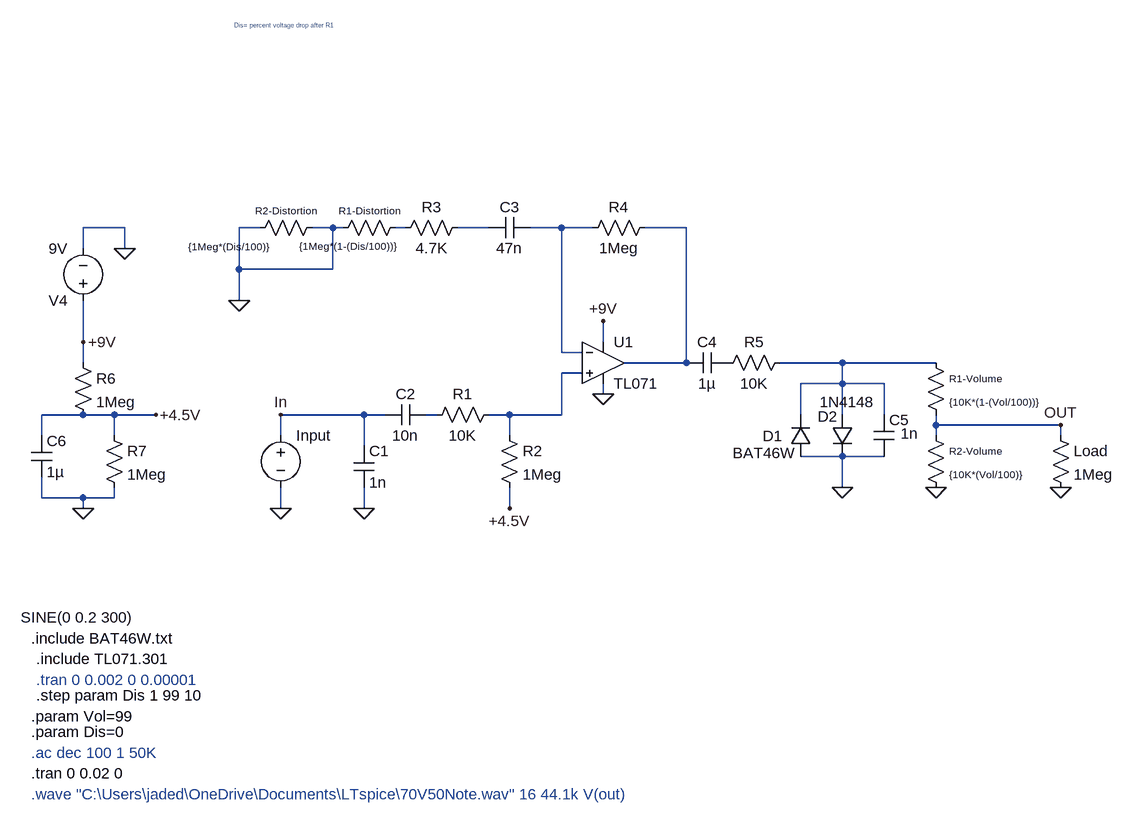
[diagram p0: schematic DistortionPedal.asc]
DistortionPedal.asc, the LTspice schematic file:
Version 4.1
SHEET 1 880 680
WIRE -1856 -368 -1920 -368
WIRE -1648 -368 -1680 -368
WIRE -1536 -368 -1568 -368
WIRE -1520 -368 -1536 -368
WIRE -1424 -368 -1440 -368
WIRE -1296 -368 -1344 -368
WIRE -1184 -368 -1232 -368
WIRE -1136 -368 -1184 -368
WIRE -992 -368 -1056 -368
WIRE -1920 -336 -1920 -368
WIRE -1856 -336 -1856 -368
WIRE -1680 -304 -1680 -368
WIRE -1536 -304 -1536 -368
WIRE -1536 -304 -1680 -304
WIRE -1680 -256 -1680 -304
WIRE -1920 -192 -1920 -256
WIRE -1120 -192 -1120 -224
WIRE -1184 -176 -1184 -368
WIRE -1152 -176 -1184 -176
WIRE -1920 -160 -1920 -192
WIRE -992 -160 -992 -368
WIRE -992 -160 -1088 -160
WIRE -976 -160 -992 -160
WIRE -752 -160 -848 -160
WIRE -608 -160 -752 -160
WIRE -1152 -144 -1184 -144
WIRE -752 -128 -752 -160
WIRE -752 -128 -816 -128
WIRE -688 -128 -752 -128
WIRE -1120 -112 -1120 -128
WIRE -1920 -80 -1984 -80
WIRE -1872 -80 -1920 -80
WIRE -1808 -80 -1872 -80
WIRE -1488 -80 -1616 -80
WIRE -1456 -80 -1488 -80
WIRE -1376 -80 -1392 -80
WIRE -1264 -80 -1296 -80
WIRE -1184 -80 -1184 -144
WIRE -1184 -80 -1264 -80
WIRE -816 -80 -816 -128
WIRE -752 -80 -752 -128
WIRE -688 -80 -688 -128
WIRE -608 -64 -608 -80
WIRE -416 -64 -608 -64
WIRE -1984 -48 -1984 -80
WIRE -1872 -48 -1872 -80
WIRE -1616 -48 -1616 -80
WIRE -1264 -48 -1264 -80
WIRE -608 -48 -608 -64
WIRE -416 -48 -416 -64
WIRE -1488 -32 -1488 -80
WIRE -752 -16 -816 -16
WIRE -688 -16 -752 -16
WIRE -752 32 -752 -16
WIRE -1984 48 -1984 16
WIRE -1920 48 -1984 48
WIRE -1872 48 -1872 32
WIRE -1872 48 -1920 48
WIRE -1920 64 -1920 48
WIRE -1616 64 -1616 32
WIRE -1488 64 -1488 32
WIRE -1264 64 -1264 32
FLAG -1680 -256 0
FLAG -1616 64 0
FLAG -1488 64 0
FLAG -1120 -112 0
FLAG -752 32 0
FLAG -608 32 0
FLAG -416 -64 OUT
FLAG -416 32 0
FLAG -1856 -336 0
FLAG -1120 -224 +9V
FLAG -1920 -192 +9V
FLAG -1920 64 0
FLAG -1808 -80 +4.5V
FLAG -1264 64 +4.5V
FLAG -1616 -80 In
SYMBOL res -1328 -384 R90
WINDOW 0 0 56 VBottom 2
WINDOW 3 32 56 VTop 2
SYMATTR InstName R3
SYMATTR Value 4.7K
SYMBOL cap -1232 -384 R90
WINDOW 0 0 32 VBottom 2
WINDOW 3 32 32 VTop 2
SYMATTR InstName C3
SYMATTR Value 47n
SYMBOL voltage -1616 -64 R0
WINDOW 3 -400 296 Left 2
WINDOW 123 0 0 Left 0
WINDOW 39 0 0 Left 0
SYMATTR Value SINE(0 0.2 300)
SYMATTR InstName Input
SYMBOL cap -1504 -32 R0
SYMATTR InstName C1
SYMATTR Value 1n
SYMBOL cap -1392 -96 R90
WINDOW 0 0 32 VBottom 2
WINDOW 3 32 32 VTop 2
SYMATTR InstName C2
SYMATTR Value 10n
SYMBOL res -1280 -96 R90
WINDOW 0 0 56 VBottom 2
WINDOW 3 32 56 VTop 2
SYMATTR InstName R1
SYMATTR Value 10K
SYMBOL res -1280 -64 R0
SYMATTR InstName R2
SYMATTR Value 1Meg
SYMBOL OpAmps\\opamp2 -1120 -224 R0
SYMATTR InstName U1
SYMATTR Value TL071
SYMATTR SpiceModel TL071
SYMBOL res -1040 -384 R90
WINDOW 0 0 56 VBottom 2
WINDOW 3 32 56 VTop 2
SYMATTR InstName R4
SYMATTR Value 1Meg
SYMBOL cap -928 -176 R90
WINDOW 0 0 32 VBottom 2
WINDOW 3 32 32 VTop 2
SYMATTR InstName C4
SYMATTR Value 1µ
SYMBOL res -832 -176 R90
WINDOW 0 0 56 VBottom 2
WINDOW 3 32 56 VTop 2
SYMATTR InstName R5
SYMATTR Value 10K
SYMBOL diode -800 -16 R180
WINDOW 0 44 31 Left 2
WINDOW 3 25 5 Left 2
SYMATTR InstName D1
SYMATTR Value BAT46W
SYMBOL diode -768 -80 R0
WINDOW 3 66 -20 Right 2
WINDOW 0 -22 3 Left 2
SYMATTR Value 1N4148
SYMATTR InstName D2
SYMBOL cap -704 -80 R0
WINDOW 3 42 29 Left 2
SYMATTR Value 1n
SYMATTR InstName C5
SYMBOL res -1424 -384 R90
WINDOW 0 0 56 VBottom 1
WINDOW 3 34 89 VTop 1
SYMATTR InstName R1-Distortion
SYMATTR Value {1Meg*(1-(Dis/100))}
SYMBOL res -1552 -384 R90
WINDOW 0 0 56 VBottom 1
WINDOW 3 35 145 VTop 1
SYMATTR InstName R2-Distortion
SYMATTR Value {1Meg*(Dis/100)}
SYMBOL res -624 -176 R0
WINDOW 0 36 40 Left 1
WINDOW 3 36 76 Left 1
SYMATTR InstName R1-Volume
SYMATTR Value {10K*(1-(Vol/100))}
SYMBOL res -624 -64 R0
WINDOW 0 36 40 Left 1
WINDOW 3 36 76 Left 1
SYMATTR InstName R2-Volume
SYMATTR Value {10K*(Vol/100)}
SYMBOL res -432 -64 R0
SYMATTR InstName Load
SYMATTR Value 1Meg
SYMBOL voltage -1920 -240 R180
WINDOW 123 0 0 Left 0
WINDOW 39 0 0 Left 0
SYMATTR InstName V4
SYMATTR Value 9V
SYMBOL res -1936 -176 R0
SYMATTR InstName R6
SYMATTR Value 1Meg
SYMBOL cap -2000 -48 R0
SYMATTR InstName C6
SYMATTR Value 1µ
SYMBOL res -1888 -64 R0
SYMATTR InstName R7
SYMATTR Value 1Meg
TEXT -1992 296 Left 2 !.include TL071.301
TEXT -1688 -680 Left 0 ;Dis= percent voltage drop after R1
TEXT -1992 328 Left 2 ;.tran 0 0.002 0 0.00001
TEXT -1992 352 Left 2 !.step param Dis 1 99 10
TEXT -2000 408 Left 2 !.param Dis=0
TEXT -2000 440 Left 2 ;.ac dec 100 1 50K
TEXT -2000 264 Left 2 !.include BAT46W.txt
TEXT -2000 472 Left 2 !.tran 0 0.02 0
TEXT -2000 384 Left 2 !.param Vol=99
TEXT -2000 504 Left 2 ;.wave "C:\\Users\\jaded\\OneDrive\\Documents\\LTspice\\70V50Note.wav" 16 44.1k V(out)

The netlist it stands for:
* DistortionPedal.asc
R3 N002 N001 4.7K
C3 N003 N002 47n
V§Input In 0 SINE(0 0.2 300)
C1 In 0 1n
C2 N007 In 10n
R1 N006 N007 10K
R2 N006 +4.5V 1Meg
X§U1 N006 N003 +9V 0 N004 TL071 TL071  ; pins In+ In- V+ V- OUT
R4 N004 N003 1Meg
C4 P001 N004 1µ
R5 N005 P001 10K
D1 0 N005 BAT46W
D2 N005 0 1N4148
C5 N005 0 1n
R1-Distortion N001 0 {1Meg*(1-(Dis/100))}
R2-Distortion 0 0 {1Meg*(Dis/100)}
R1-Volume N005 OUT {10K*(1-(Vol/100))}
R2-Volume OUT 0 {10K*(Vol/100)}
R§Load OUT 0 1Meg
V4 +9V 0 9V
R6 +9V +4.5V 1Meg
C6 +4.5V 0 1µ
R7 +4.5V 0 1Meg
.model D D
.lib standard.dio
.include TL071.301
* Dis= percent voltage drop after R1
* .tran 0 0.002 0 0.00001
.step param Dis 1 99 10
.param Dis=0
* .ac dec 100 1 50K
.include BAT46W.txt
.tran 0 0.02 0
.param Vol=99
* .wave "C:\Users\jaded\OneDrive\Documents\LTspice\70V50Note.wav" 16 44.1k V(out)
.backanno
.end